# EAGLE design T-Board-328 Etch - v0.3 (EAGLE 6.5.0)
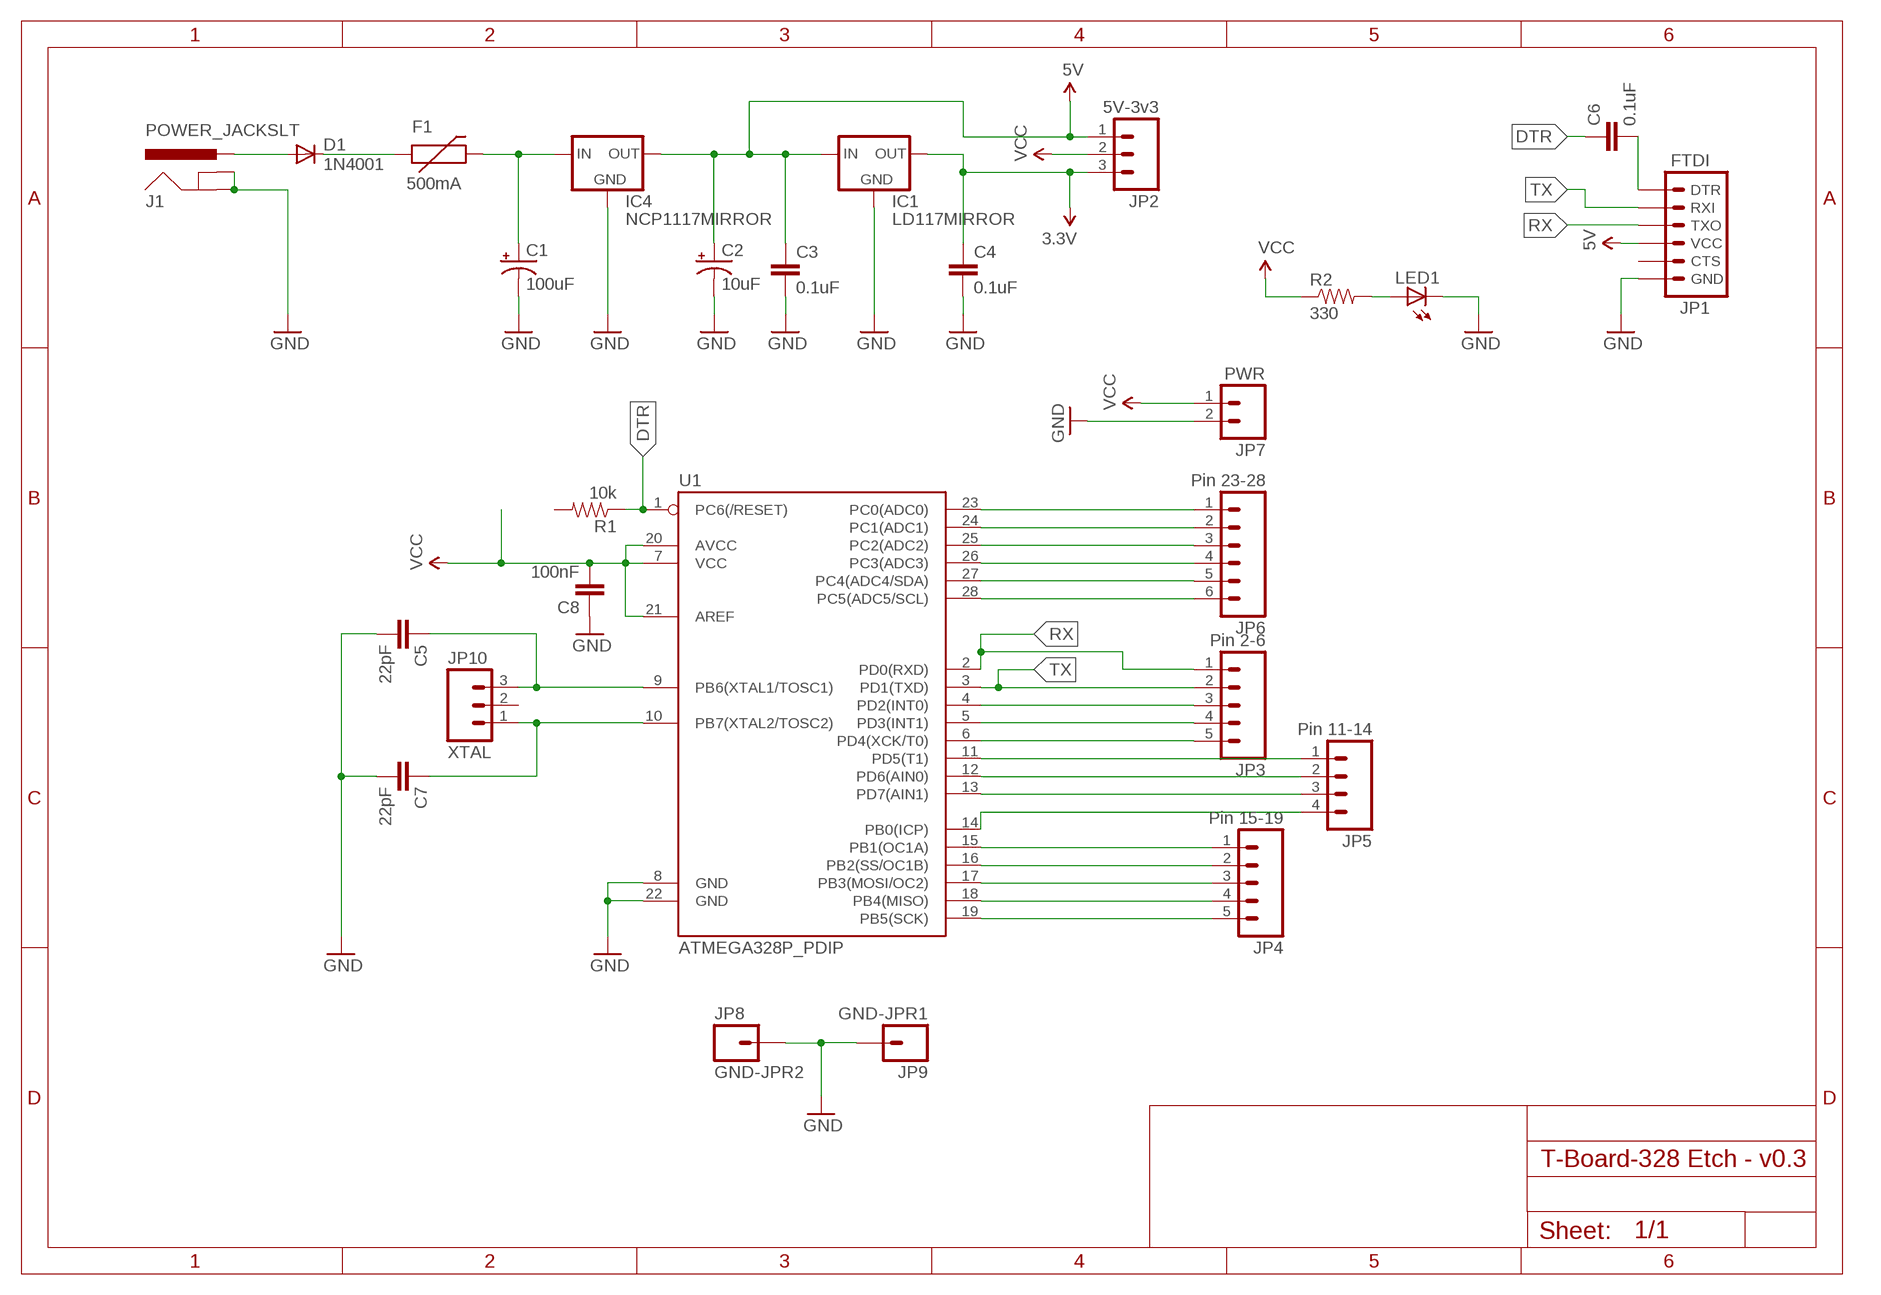
[diagram p0: schematic, sheet 1]

## Parts
C1  100uF  CAP_POLPTH1  [CPOL-RADIAL-100UF-25V]
C2  10uF  CAP_POLPTH2  [CPOL-RADIAL-10UF-25V]
C3  0.1uF  CAPPTH1  [CAP-PTH-5MM]
C4  0.1uF  CAPPTH1  [CAP-PTH-5MM]
C5  22pF  CAPPTH1  [CAP-PTH-5MM]
C6  0.1uF  CAPPTH1  [CAP-PTH-5MM]
C7  22pF  CAPPTH1  [CAP-PTH-5MM]
C8  100nF  CAPPTH1  [CAP-PTH-5MM]
D1  1N4001  DIODEPTH  [DIODE-1N4001]
F1  500mA  PTCPTH  [PTC]
IC1  LD117MIRROR  [SOT223]
IC4  NCP1117MIRROR  [DPACK]
J1  POWER_JACKSLT  [POWER_JACK_SLOT]
JP1  FTDI  ARDUINO_SERIAL_PROGRAMLOCK  [1X06_LOCK]
JP2  5V-3v3  M03LOCK  [1X03_LOCK]
JP3  Pin 2-6  M05LOCK  [1X05_LOCK]
JP4  Pin 15-19  M05LOCK  [1X05_LOCK]
JP5  Pin 11-14  M04LOCK  [1X04_LOCK]
JP6  Pin 23-28  M06LOCK  [1X06_LOCK]
JP7  PWR  M02LOCK  [1X02_LOCK]
JP8  GND-JPR2  M01PTH_LONGPAD  [1X01_LONGPAD]
JP9  GND-JPR1  M01PTH_LONGPAD  [1X01_LONGPAD]
JP10  XTAL  M03LOCK  [1X03_LOCK]
LED1  LED3MM  [LED3MM]
R1  10k  RESISTOR1206  [1206]
R2  330  RESISTORPTH-1/2W  [AXIAL-0.5]
U1  ATMEGA328P_PDIP  [DIL28-3]

## Nets
3.3V: C4.1 IC1.4(OUT) JP2.3
5V: C2.1(+) C3.1 IC1.1(IN) IC4.4(OUT) JP1.4(VCC) JP2.1
DTR: C6.1 R1.1 U1.1(PC6(/RESET))
GND: C1.2(-) C2.2(-) C3.2 C4.2 C5.2 C7.2 C8.1 IC1.3(GND) IC4.3(GND) J1.GND@1(GNDBREAK) J1.GND@2(GND) JP1.6(GND) JP7.2 JP8.1 JP9.1 LED1.K(C) U1.8(GND) U1.22(GND)
N$1: D1.A J1.PWR
N$2: JP6.1 U1.23(PC0(ADC0))
N$3: D1.C F1.P$1
N$4: C1.1(+) F1.P$2 IC4.1(IN)
N$5: JP6.6 U1.28(PC5(ADC5/SCL))
N$6: C6.2 JP1.1(DTR)
N$7: C7.1 JP10.1 U1.10(PB7(XTAL2/TOSC2))
N$8: C5.1 JP10.3 U1.9(PB6(XTAL1/TOSC1))
N$9: LED1.A R2.P$2
N$10: JP3.3 U1.4(PD2(INT0))
N$11: JP3.4 U1.5(PD3(INT1))
N$12: JP3.5 U1.6(PD4(XCK/T0))
N$13: JP5.1 U1.11(PD5(T1))
N$14: JP5.2 U1.12(PD6(AIN0))
N$15: JP5.3 U1.13(PD7(AIN1))
N$16: JP5.4 U1.14(PB0(ICP))
N$17: JP4.1 U1.15(PB1(OC1A))
N$18: JP4.2 U1.16(PB2(SS/OC1B))
N$19: JP4.3 U1.17(PB3(MOSI/OC2))
N$20: JP4.4 U1.18(PB4(MISO))
N$21: JP4.5 U1.19(PB5(SCK))
N$22: JP6.2 U1.24(PC1(ADC1))
N$23: JP6.3 U1.25(PC2(ADC2))
N$24: JP6.4 U1.26(PC3(ADC3))
N$25: JP6.5 U1.27(PC4(ADC4/SDA))
RX: JP1.3(TXO) JP3.1 U1.2(PD0(RXD))
TX: JP1.2(RXI) JP3.2 U1.3(PD1(TXD))
VCC: C8.2 JP2.2 JP7.1 R2.P$1 U1.7(VCC) U1.20(AVCC) U1.21(AREF)
Unconnected: JP1.5(CTS) JP10.2 R1.2

## Library data of the parts
C1 C2 = SparkFun-Capacitors:CAP_POL: Capacitor Polarized These are standard SMD and PTH capacitors. Normally 10uF, 47uF, and 100uF in electrolytic and tantalum varieties. Always verify the external diameter of the through hole cap, it varies with capacity, voltage, and manufacturer. The EIA devices should be standard.
C3-C8 = SparkFun-Capacitors:CAP: Capacitor Standard 0603 ceramic capacitor, and 0.1" leaded capacitor.
D1 = SparkFun-DiscreteSemi:DIODE: Diode These are standard reverse protection diodes and small signal diodes. SMA package can handle up to about 1A. SOD-323 can handle about 200mA. What the SOD-323 package when ordering, there are some mfgs out there that are 5-pin packages.
F1 = SparkFun-PowerIC:PTC: Resettable Fuse PTC Resettable Fuse. Spark Fun Electronics SKU : COM-08357
IC1 = AndyTallack:LD117: Low drop fixed and adjustable positive voltage regulators 1 A Source: http://www.st.com/stonline/products/literature/ds/7194/ld1117axx.pdf
IC4 = AndyTallack:NCP1117: NCP1117 ON Semiconductor low dropout fixed voltage regulator
J1 = SparkFun-Connectors:POWER_JACK: Power Jack This is the standard 5.5mm barrel jack for power. The PTH is the most common, proven, reliable, footprint. The Slot footprint only works if the mill layer is transmitted to the PCB fab house so be warned. Spark Fun Electronics SKU : PRT-00119 SMT: CONN-08106 Mating wall wart : TOL-00298 (and others)
JP1 = SparkFun-Connectors:ARDUINO_SERIAL_PROGRAM: FTDI connector footprints
JP2 JP10 = SparkFun-Connectors:M03: Header 3 Standard 3-pin 0.1" header. Use with straight break away headers (SKU : PRT-00116), right angle break away headers (PRT-00553), swiss pins (PRT-00743), machine pins (PRT-00117), and female headers (PRT-00115). Molex polarized connector foot print use with SKU : PRT-08232 with associated crimp pins and housings.
JP3 JP4 = SparkFun-Connectors:M05: Header 5 Standard 5-pin 0.1" header. Use with straight break away headers (SKU : PRT-00116), right angle break away headers (PRT-00553), swiss pins (PRT-00743), machine pins (PRT-00117), and female headers (PRT-00115). Molex polarized connector foot print use with SKU : PRT-08230 with associated crimp pins and housings.
JP5 = SparkFun-Connectors:M04: Header 4 Standard 4-pin 0.1" header. Use with straight break away headers (SKU : PRT-00116), right angle break away headers (PRT-00553), swiss pins (PRT-00743), machine pins (PRT-00117), and female headers (PRT-00115). Molex polarized connector foot print use with SKU : PRT-08231 with associated crimp pins and housings. 1MM SMD Version SKU: PRT-10208
JP6 = SparkFun-Connectors:M06: Header 6 Standard 6-pin 0.1" header. Use with straight break away headers (SKU : PRT-00116), right angle break away headers (PRT-00553), swiss pins (PRT-00743), machine pins (PRT-00117), and female headers (PRT-00115). Molex polarized connector foot print use with SKU : PRT-08094 with associated crimp pins and housings. NOTES ON THE VARIANTS LOCK and LOCK_LONGPADS... This footprint was designed to help hold the alignment of a through-hole component (i.e. 6-pin header) while soldering it into place. You may notice that each hole has been shifted either up or down by 0.005 of an inch from it's more standard position (which is a perfectly straight line). This slight alteration caused the pins (the squares in the middle) to touch the edges of the holes. Because they are alternating, it causes a "brace" to hold the component in place. 0.005 has proven to be the perfect amount of "off-center" position when using our standard breakaway headers. Although looks a little odd when you look at the bare footprint, once you have a header in there, the alteration is very hard to notice. Also, if you push a header all the way into place, it is covered up entirely on the bottom side. This idea of altering the position of holes to aid alignment will be further integrated into the Sparkfun Library for other footprints. It can help hold any component with 3 or more connection pins.
JP7 = SparkFun-Connectors:M02: Header 2 Standard 2-pin 0.1" header. Use with straight break away headers (SKU : PRT-00116), right angle break away headers (PRT-00553), swiss pins (PRT-00743), machine pins (PRT-00117), and female headers (PRT-00115). Molex polarized connector foot print use with SKU : PRT-08233 with associated crimp pins and housings.
JP8 JP9 = SparkFun-Connectors:M01: Header 1 Standard 1-pin 0.1" header. Use with straight break away headers (SKU : PRT-00116), right angle break away headers (PRT-00553), swiss pins (PRT-00743), machine pins (PRT-00117), and female headers (PRT-00115).
LED1 = led:LED: LED OSRAM: - CHIPLED LG R971, LG N971, LY N971, LG Q971, LY Q971, LO R971, LY R971 LH N974, LH R974 LS Q976, LO Q976, LY Q976 LO Q996 - Hyper CHIPLED LW Q18S LB Q993, LB Q99A, LB R99A - SideLED LS A670, LO A670, LY A670, LG A670, LP A670 LB A673, LV A673, LT A673, LW A673 LH A674 LY A675 LS A676, LA A676, LO A676, LY A676, LW A676 LS A679, LY A679, LG A679 - Hyper Micro SIDELED® LS Y876, LA Y876, LO Y876, LY Y876 LT Y87S - SmartLED LW L88C, LW L88S LB L89C, LB L89S, LG L890 LS L89K, LO L89K, LY L89K LS L896, LA L896, LO L896, LY L896 - TOPLED LS T670, LO T670, LY T670, LG T670, LP T670 LSG T670, LSP T670, LSY T670, LOP T670, LYG T670 LG T671, LOG T671, LSG T671 LB T673, LV T673, LT T673, LW T673 LH T674 LS T676, LA T676, LO T676, LY T676, LB T676, LH T676, LSB T676, LW T676 LB T67C, LV T67C, LT T67C, LS T67K, LO T67K, LY T67K, LW E67C LS E67B, LA E67B, LO E67B, LY E67B, LB E67C, LV E67C, LT E67C LW T67C LS T679, LY T679, LG T679 LS T770, LO T770, LY T770, LG T770, LP T770 LB T773, LV T773, LT T773, LW T773 LH T774 LS E675, LA E675, LY E675, LS T675 LS T776, LA T776, LO T776, LY T776, LB T776 LHGB T686 LT T68C, LB T68C - Hyper Mini TOPLED® LB M676 - Mini TOPLED Santana® LG M470 LS M47K, LO M47K, LY M47K Source: http://www.osram.convergy.de LUXEON: - LUMILED® LXK2-PW12-R00, LXK2-PW12-S00, LXK2-PW14-U00, LXK2-PW14-V00 LXK2-PM12-R00, LXK2-PM12-S00, LXK2-PM14-U00 LXK2-PE12-Q00, LXK2-PE12-R00, LXK2-PE12-S00, LXK2-PE14-T00, LXK2-PE14-U00 LXK2-PB12-K00, LXK2-PB12-L00, LXK2-PB12-M00, LXK2-PB14-N00, LXK2-PB14-P00, LXK2-PB14-Q00 LXK2-PR12-L00, LXK2-PR12-M00, LXK2-PR14-Q00, LXK2-PR14-R00 LXK2-PD12-Q00, LXK2-PD12-R00, LXK2-PD12-S00 LXK2-PH12-R00, LXK2-PH12-S00 LXK2-PL12-P00, LXK2-PL12-Q00, LXK2-PL12-R00 Source: www.luxeon.com KINGBRIGHT: KA-3528ASYC Source: www.kingbright.com
R1 R2 = SparkFun-Passives:RESISTOR: Resistor Basic schematic elements and footprints for 0603, 1206, and PTH resistors.
U1 = SparkFun-DigitalIC:ATMEGA328P_PDIP: uC used in the Arduino 32kb flash, 1k EEPROM, 2k SRAM This is the through-hole version of this chip.

## Board
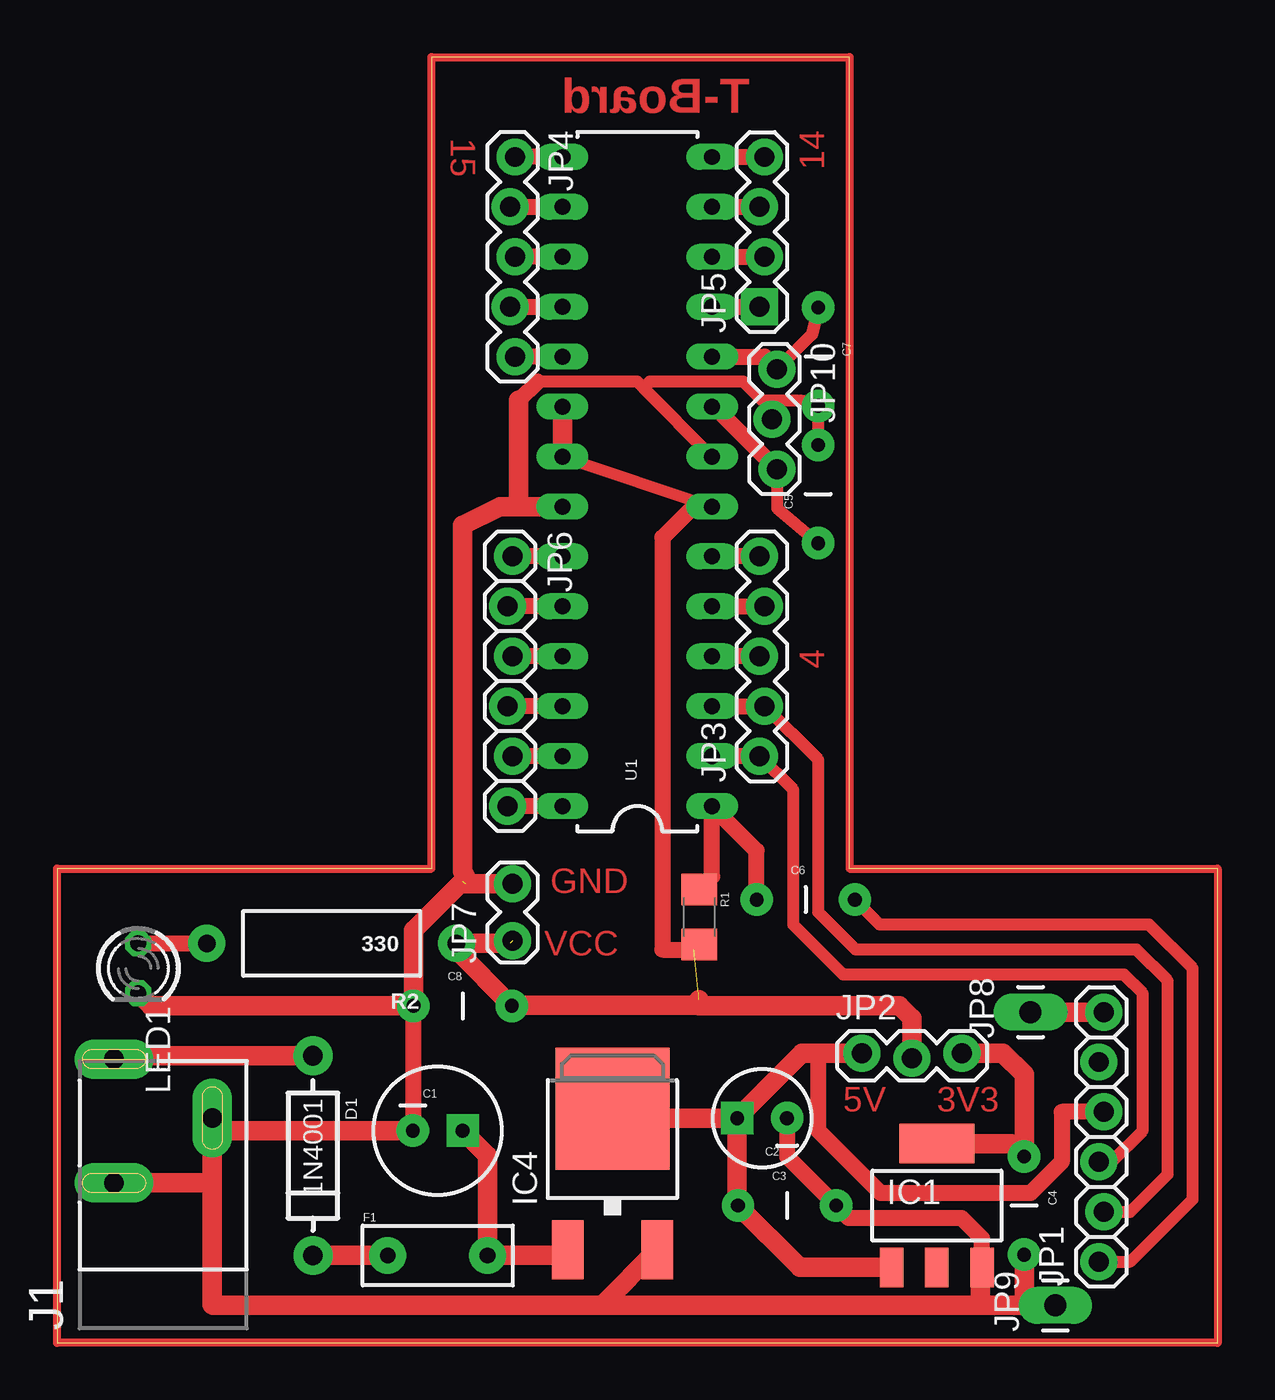
[diagram p1: board, top side]
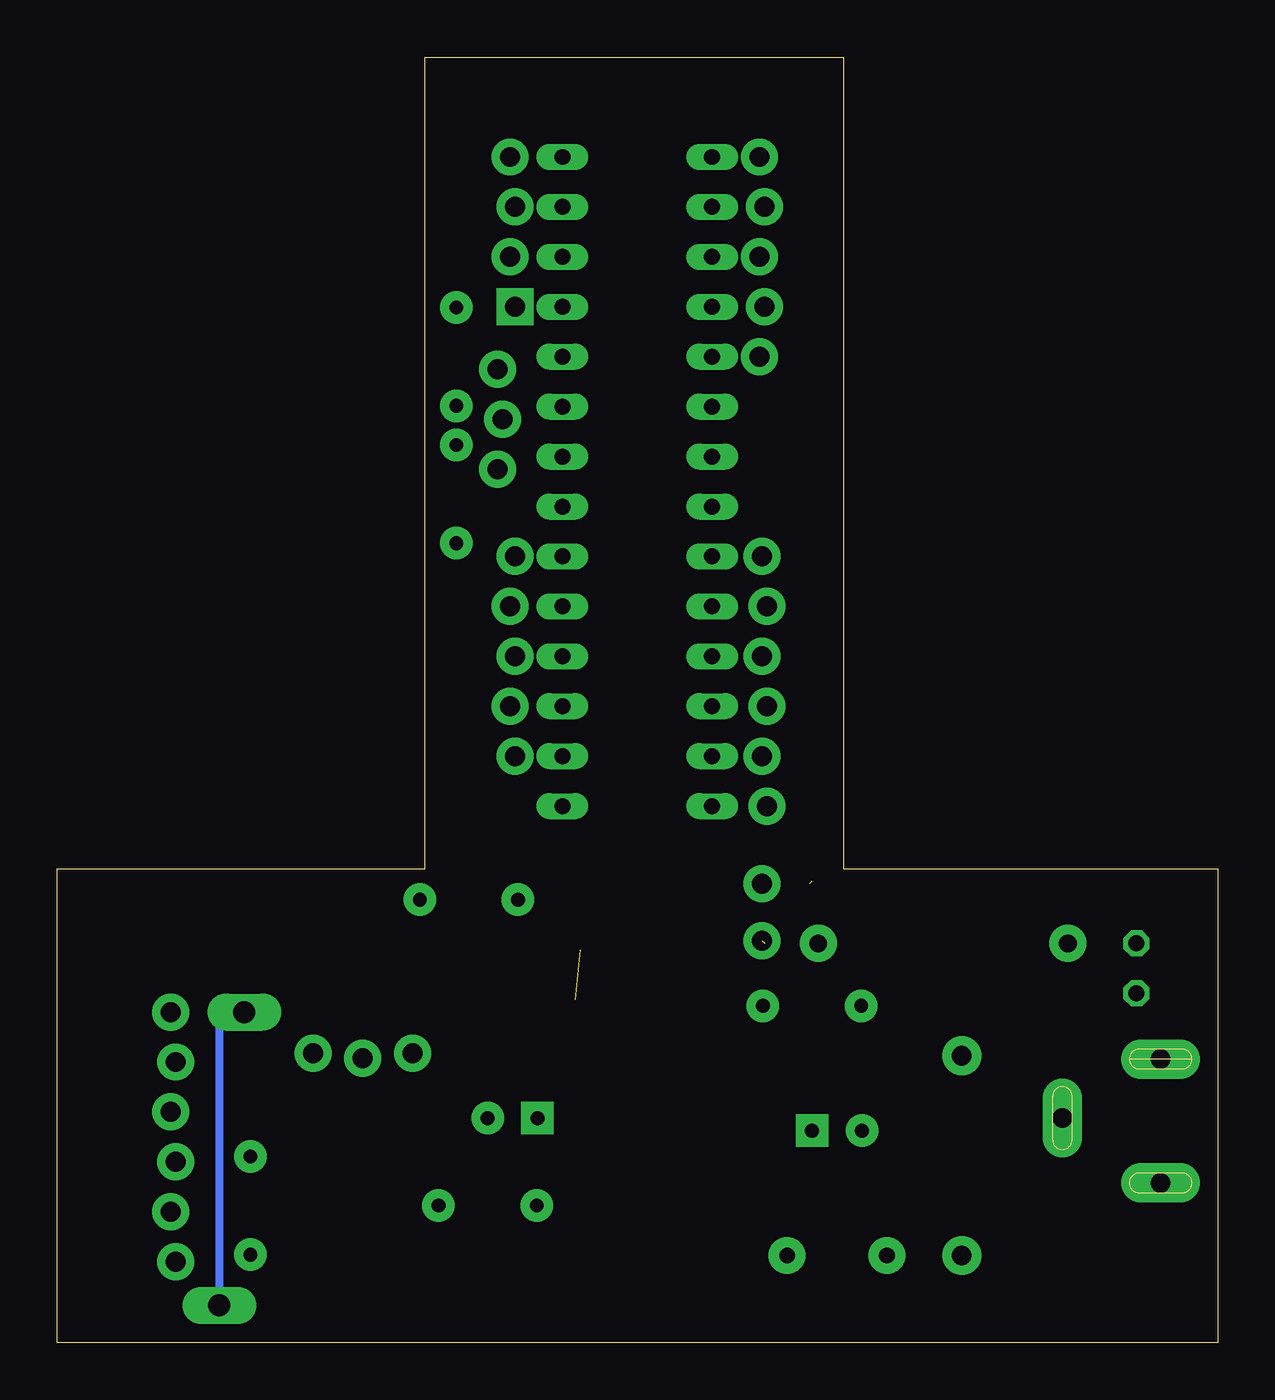
[diagram p2: board, bottom side, seen from below]

Size 59.05 x 65.41 mm. Coordinates in mm from the lower left corner, seen from the top.
Outline: 0,0 59.05,0 59.05,24.13 40.32,24.13 40.32,65.41 19.05,65.41 19.05,24.13 0,24.13 0,0
Copper layers (1*16): Top 0.035mm / dielectric 1.5mm / Bottom 0.035mm
Design rules "default": minimum track width 10mil, minimum drill 24mil, track to track 8mil, track to pad 8mil, pad to pad 8mil, via to via 8mil, smd to smd 8mil, copper to edge 40mil, drill to drill 8mil, minimum pad ring 10mil, minimum via ring 8mil, stop-mask expansion 4mil, vias tented up to drill 0mil, thermal gap 10mil

### Footprints (pad centres in the part's own frame; a part is rotated, then mirrored left to right if it is on the bottom)
CPOL-RADIAL-100UF-25V = drill 0.7 pad 1.651 square: 1 1.27,0 | drill 0.7 pad 1.651: 2 -1.27,0
CPOL-RADIAL-10UF-25V = drill 0.7 pad 1.651 square: 1 1.27,0 | drill 0.7 pad 1.651: 2 -1.27,0
CAP-PTH-5MM = drill 0.7 pad 1.651: 1 -2.5,0; 2 2.5,0
DIODE-1N4001 = drill 1 pad 1.981: A -5.08,0; C 5.08,0
PTC = drill 0.8 pad 1.88: P$1 -2.54,0; P$2 2.54,0
SOT223 = smd 1.2 x 2: 1 -2.3,-3.15; 2 0,-3.15; 3 2.3,-3.15 | smd 3.8 x 2: 4 0,3.15
DPACK = smd 1.6 x 3: 1 -2.28,-4.8; 3 2.28,-4.8 | smd 5.8 x 6.2: 4 0,2.38
POWER_JACK_SLOT = drill 1 pad 2 long: GND@1 2.58,7.5; GND@2 7.58,10.8; PWR 2.58,13.8
1X06_LOCK = drill 1.016 pad 1.88: 1 0,0; 2 2.54,-0.254; 3 5.08,0; 4 7.62,-0.254; 5 10.16,0; 6 12.7,-0.254
1X03_LOCK = drill 1.016 pad 1.88: 1 0,0.127; 2 2.54,-0.127; 3 5.08,0.127
1X05_LOCK = drill 1.016 pad 1.88: 1 0,0.127; 2 2.54,-0.127; 3 5.08,0.127; 4 7.62,-0.127; 5 10.16,0.127
1X04_LOCK = drill 1.016 pad 1.88 square: 1 0,0.127 | drill 1.016 pad 1.88: 2 2.54,-0.127; 3 5.08,0.127; 4 7.62,-0.127
1X02_LOCK = drill 1.016 pad 1.88: 1 -0.178,0; 2 2.718,0
1X01_LONGPAD = drill 1.118 pad 1.88 long: 1 0,0
LED3MM = drill 0.813 octagon: A -1.27,0; K 1.27,0
1206 = smd 1.6 x 1.8: 1 -1.4,0; 2 1.4,0
AXIAL-0.5 = drill 0.9 pad 1.88: P$1 -6.35,0; P$2 6.35,0
DIL28-3 = drill 0.813 long: 1 -16.51,-3.81; 2 -13.97,-3.81; 3 -11.43,-3.81; 4 -8.89,-3.81; 5 -6.35,-3.81; 6 -3.81,-3.81; 7 -1.27,-3.81; 8 1.27,-3.81; 9 3.81,-3.81; 10 6.35,-3.81; 11 8.89,-3.81; 12 11.43,-3.81; 13 13.97,-3.81; 14 16.51,-3.81; 15 16.51,3.81; 16 13.97,3.81; 17 11.43,3.81; 18 8.89,3.81; 19 6.35,3.81; 20 3.81,3.81; 21 1.27,3.81; 22 -1.27,3.81; 23 -3.81,3.81; 24 -6.35,3.81; 25 -8.89,3.81; 26 -11.43,3.81; 27 -13.97,3.81; 28 -16.51,3.81

### Placement (x,y rotation side)
C1  19.37,10.79 0 top
C2  35.88,11.43 180 top
C3  37.15,6.98 0 top
C4  49.21,6.98 270 top
C5  38.73,43.18 90 top
C6  38.1,22.54 0 top
C7  38.73,50.16 270 top
C8  20.64,17.15 0 top
D1  13.02,9.53 270 top
F1  19.37,4.45 0 top
IC1  44.77,6.98 0 top
IC4  28.26,9.53 0 top
J1  0.32,0.64 0 top
JP1  53.02,4.13 90 top
JP2  40.96,14.61 0 top
JP3  35.88,29.85 90 top
JP4  23.18,60.32 270 top
JP5  35.88,52.7 90 top
JP6  23.18,40 270 top
JP7  23.18,20.64 90 top
JP8  49.53,16.83 90 top
JP9  50.8,1.91 90 top
JP10  36.51,49.53 270 top
LED1  4.13,19.05 270 top
R1  32.67,21.66 270 top
R2  13.97,20.32 180 top
U1  29.53,43.81 90 top

### Tracks (layer width: path | path; a pad name or v marks a point on that pad's centre or on a via)
3.3V
  Top 1: IC1.4 48.56,10.13 C4.1 49.21,13.65 48.13,14.73 JP2.3
5V
  Top 0.813: JP1.4 51.12,11.75 51.12,9.21 49.53,7.62 41.91,7.62 38.73,10.79 38.73,14.73
  Top 1: 29.53,12.06 28.26,12.06 IC4.4 28.73,11.43 C2.1 | C2.1 34.61,6.98 C3.1 37.8,3.83 IC1.1 | C2.1 37.91,14.73 38.73,14.73 JP2.1
DTR
  Top 0.813: C6.1 35.6,25.04 U1.1 33.34,23.73 R1.1
GND  (1 unrouted)
  Top 0.61: C1.2 18.14,10.83 | U1.8 29.84,48.58 | 29.84,48.58 30.16,48.89 34.93,48.89 35.88,47.94 37.47,47.94 arc-32 C7.2 C5.2 | 29.84,48.58 29.53,48.89 24.45,48.89
  Top 0.813: 18.14,10.83 C8.1 | C2.2 37.15,9.48 C3.2 40.28,6.35 46.04,6.35 47.07,5.32 IC1.3 | 24.45,48.89 23.49,47.94
  Top 1: J1.GND@1 7.9,8.13 | 7.9,8.13 J1.GND@2 8.54,10.79 C1.2 | IC4.3 27.72,1.91 | 27.72,1.91 7.94,1.91 7.9,1.95 7.9,8.13 | 49.21,1.91 46.99,1.91 | 46.99,1.91 27.72,1.91 | 20.64,23.5 18.14,21 C8.1 4.76,17.15 LED1.K | 20.78,23.36 20.95,23.36 | 20.95,23.36 JP7.2 | 23.49,47.94 23.49,42.54 | 23.49,42.54 U1.22 | 23.49,42.54 22.54,42.54 20.64,41.59 20.64,23.99 20.95,23.36 | IC1.3 46.99,3.76 46.99,1.91 | C4.2 49.21,1.91 | JP8.1 JP1.6 | 49.21,1.91 JP9.1
  Bottom 0.406: JP8.1 50.8,16.83 JP9.1
N$1
  Top 1: J1.PWR 3.07,14.61 D1.A
N$2
  Top 0.813: U1.23 JP6.1
N$3
  Top 1: D1.C F1.P$1
N$4
  Top 1: C1.1 21.91,9.53 F1.P$2 25.98,4.45 IC4.1
N$5
  Top 0.813: U1.28 JP6.6
N$6
  Top 0.61: JP1.1 54.61,4.13 57.79,7.3 57.79,19.05 55.56,21.27 41.87,21.27 C6.2
N$7
  Top 0.61: C7.1 38.42,51.31 JP10.1
  Top 0.813: U1.10 36,50.16 JP10.1
N$8
  Top 0.61: JP10.3 36.64,42.46 C5.1
  Top 0.813: U1.9 33.46,47.62 JP10.3
N$9
  Top 0.813: LED1.A R2.P$2
N$10
  Top 0.813: JP3.3 U1.4
N$11
  Top 0.813: U1.5 JP3.4
N$12
  Top 0.813: JP3.5 U1.6
N$13
  Top 0.813: U1.11 JP5.1
N$14
  Top 0.813: U1.12 JP5.2
N$15
  Top 0.813: U1.13 JP5.3
N$16
  Top 0.813: U1.14 JP5.4
N$17
  Top 0.813: U1.15 JP4.1
N$18
  Top 0.813: JP4.2 U1.16
N$19
  Top 0.813: U1.17 JP4.3
N$20
  Top 0.813: JP4.4 U1.18
N$21
  Top 0.813: U1.19 JP4.5
N$22
  Top 0.813: U1.24 JP6.2
N$23
  Top 0.813: U1.25 JP6.3
N$24
  Top 0.813: U1.26 JP6.4
N$25
  Top 0.813: U1.27 JP6.5
N$26
  Top 0.406: 0,0 0,24.13 19.05,24.13 19.05,65.41 40.32,65.41 40.32,24.13 59.05,24.13 59.05,0 0,0
RX
  Top 0.61: JP1.3 53.66,9.21 55.25,10.79 55.25,17.78 54.29,18.73 40.01,18.73 37.47,21.27 37.47,28.13 JP3.1
  Top 0.813: JP3.1 U1.2
TX
  Top 0.61: JP1.2 54.61,6.67 56.51,8.57 56.51,18.42 54.93,20 40.64,20 38.73,21.91 38.73,29.66 JP3.2
  Top 0.813: U1.3 JP3.2
VCC  (2 unrouted)
  Top 0.61: U1.21 U1.7
  Top 0.813: 23.18,17.19 C8.2 | R2.P$1 20.32,19.96 | 32.39,17.19 32.67,17.46 | U1.7 32.39,42.54 30.8,40.96 30.8,20 32.41,20
  Top 1: U1.21 U1.20 | JP2.2 43.5,16.51 42.86,17.15 32.67,17.15 32.67,17.46 | R2.P$1 23.04,20.32 | 20.32,19.96 C8.2 | 23.18,17.19 32.39,17.19

### Text on the board
Top: T-Board | 15 | 14 | 4 | GND | VCC | 5V | 3V3